# EAGLE design atxmega_e5_1 (EAGLE 6.5.0)
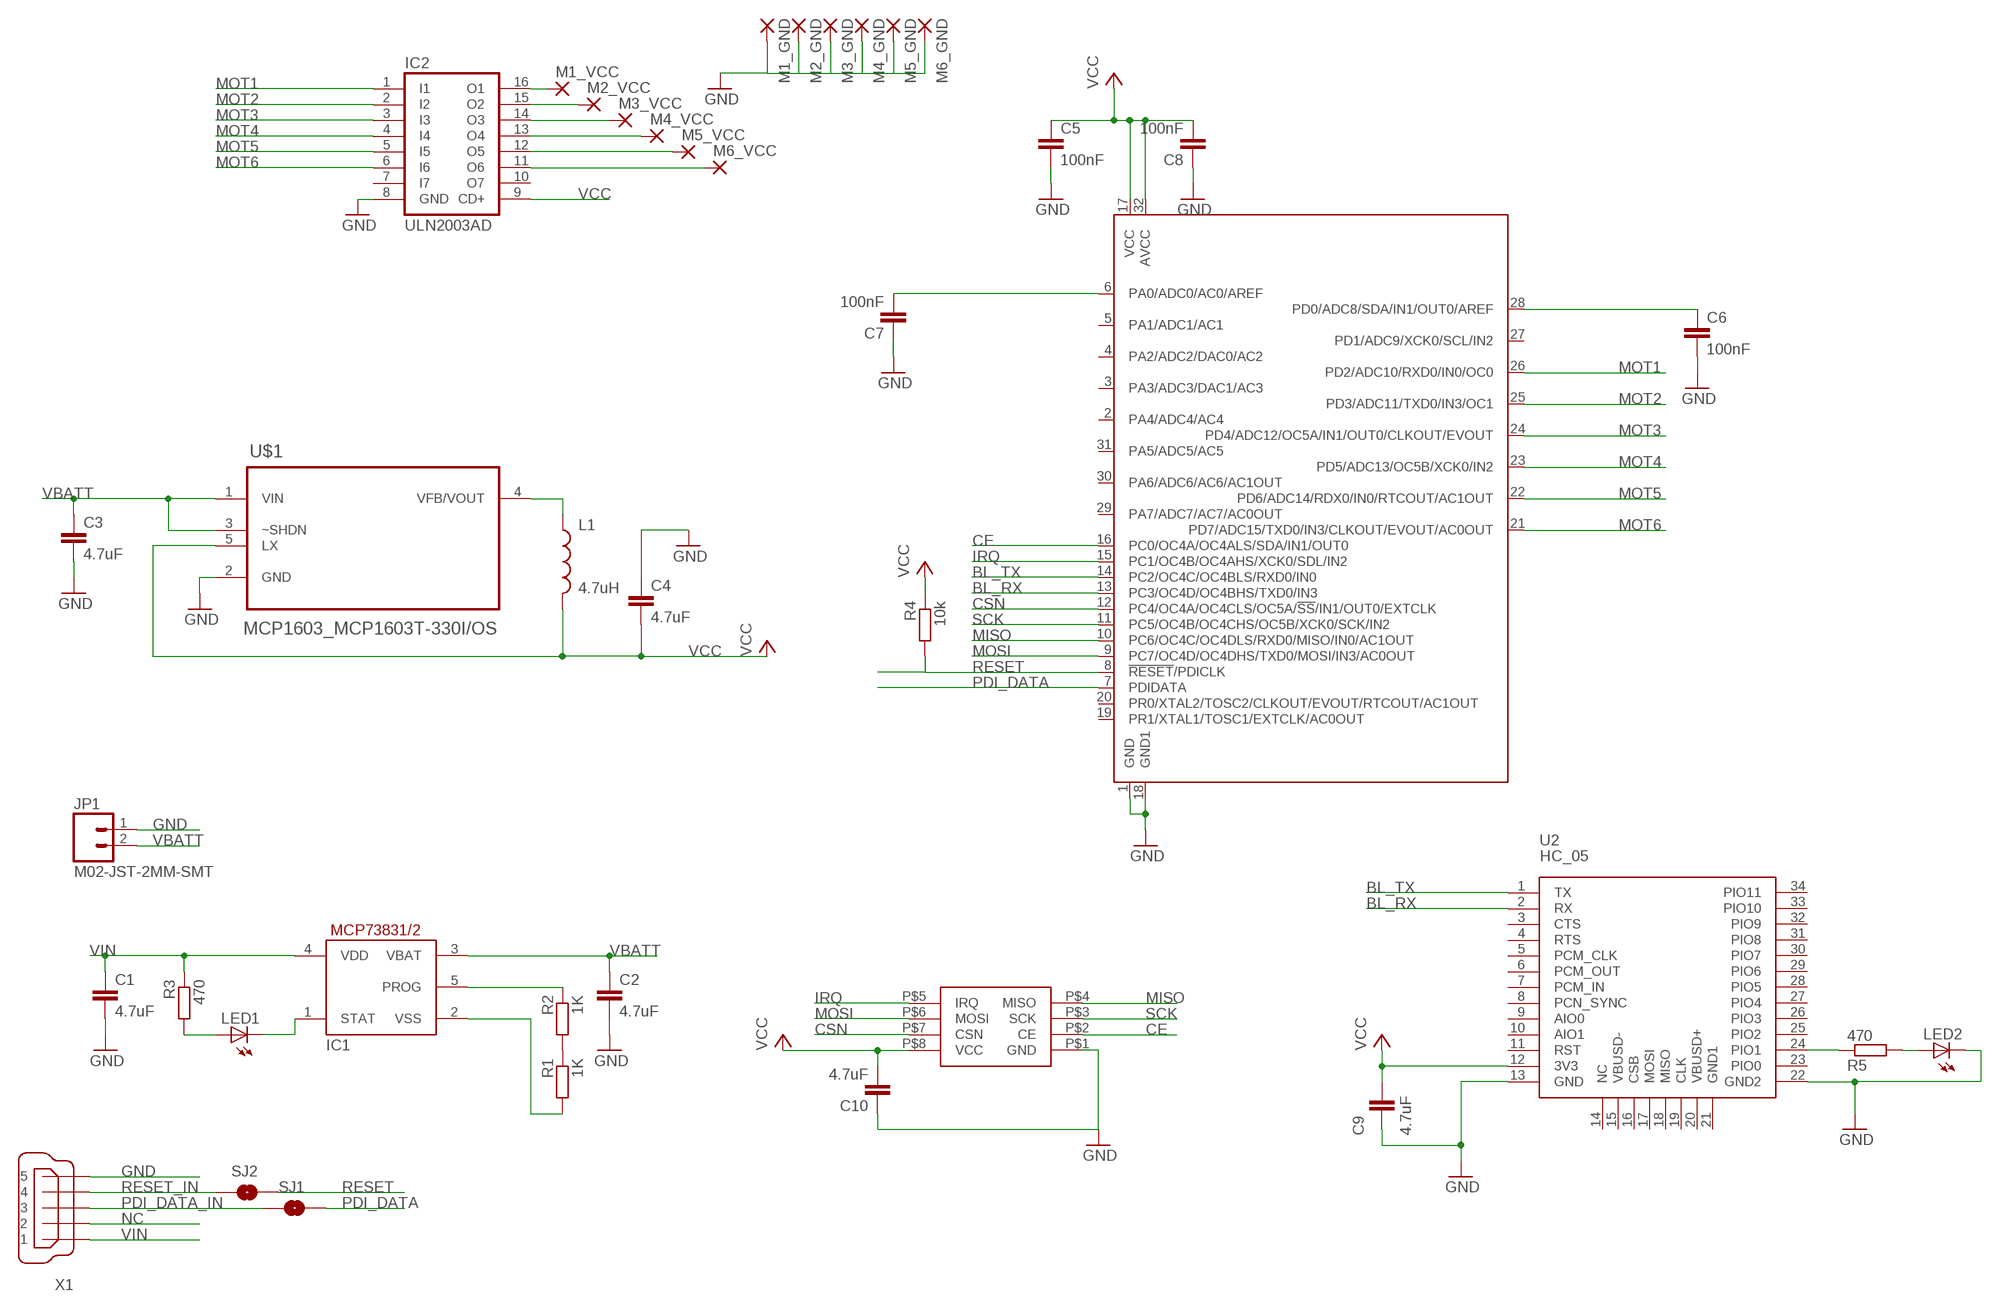
[diagram p0: schematic, sheet 1]

## Parts
C1  4.7uF  C-EUC0603K  [C0603K]
C2  4.7uF  C-EUC0603K  [C0603K]
C3  4.7uF  C-EUC0603K  [C0603K]
C4  4.7uF  C-EUC0603K  [C0603K]
C5  100nF  C-EUC0603K  [C0603K]
C6  100nF  C-EUC0603K  [C0603K]
C7  100nF  C-EUC0603K  [C0603K]
C8  100nF  C-EUC0603K  [C0603K]
C9  4.7uF  C-EUC0603K  [C0603K]
C10  4.7uF  C-EUC0603K  [C0603K]
IC1  MCP73831/OT  [SOT23-5L]
IC2  ULN2003AD  [SO16]
JP1  M02-JST-2MM-SMT  [JST-2-SMD]
L1  4.7uH  INDUCTOR1007  [1007]
LED1  LED0805LED  [0805LED]
LED2  LED0805LED  [0805LED]
M1_GND  WIREPAD2,15/1,0  [2,15/1,0]
M1_VCC  WIREPAD2,15/1,0  [2,15/1,0]
M2_GND  WIREPAD2,15/1,0  [2,15/1,0]
M2_VCC  WIREPAD2,15/1,0  [2,15/1,0]
M3_GND  WIREPAD2,15/1,0  [2,15/1,0]
M3_VCC  WIREPAD2,15/1,0  [2,15/1,0]
M4_GND  WIREPAD2,15/1,0  [2,15/1,0]
M4_VCC  WIREPAD2,15/1,0  [2,15/1,0]
M5_GND  WIREPAD2,15/1,0  [2,15/1,0]
M5_VCC  WIREPAD2,15/1,0  [2,15/1,0]
M6_GND  WIREPAD2,15/1,0  [2,15/1,0]
M6_VCC  WIREPAD2,15/1,0  [2,15/1,0]
R1  1K  R-EU_R0603  [R0603]
R2  1K  R-EU_R0603  [R0603]
R3  470  R-EU_R0603  [R0603]
R4  10k  R-EU_R0603  [R0603]
R5  470  R-EU_R0603  [R0603]
SJ1  SOLDERJUMPERNO  [SJ_2S-NO]
SJ2  SOLDERJUMPERNO  [SJ_2S-NO]
U1  ATXMEGAE5AU  [TQFP32]
U2  HC_05  [BLUETOOTH_SMD]
U$1  MCP1603_MCP1603T-330I/OS  [MCP1603_SOT95P280X110-5N]
U$2  NRF24L01+  [NRF24L01+]
X1  MINI-USB-32005-201  [32005-201]

## Nets
BL_RX: U1.13(PC3/OC4D/OC4BHS/TXD0/IN3) U2.2(RX)
BL_TX: U1.14(PC2/OC4C/OC4BLS/RXD0/IN0) U2.1(TX)
CE: U1.16(PC0/OC4A/OC4ALS/SDA/IN1/OUT0) U$2.P$2(CE)
CSN: U1.12(PC4/OC4A/OC4CLS/OC5A/!SS!/IN1/OUT0/EXTCLK) U$2.P$7(CSN)
GND: C1.2 C2.2 C3.2 C4.1 C5.2 C6.2 C7.1 C8.1 C9.2 C10.1 IC2.8(GND) JP1.1 LED2.C M1_GND.1(P) M2_GND.1(P) M3_GND.1(P) M4_GND.1(P) M5_GND.1(P) M6_GND.1(P) U1.1(GND) U1.18(GND1) U2.13(GND) U2.22(GND2) U$1.2(GND) U$2.P$1(GND) X1.5
IRQ: U1.15(PC1/OC4B/OC4AHS/XCK0/SDL/IN2) U$2.P$5(IRQ)
MISO: U1.10(PC6/OC4C/OC4DLS/RXD0/MISO/IN0/AC1OUT) U$2.P$4(MISO)
MOSI: U1.9(PC7/OC4D/OC4DHS/TXD0/MOSI/IN3/AC0OUT) U$2.P$6(MOSI)
MOT1: IC2.1(I1) U1.26(PD2/ADC10/RXD0/IN0/OC0)
MOT2: IC2.2(I2) U1.25(PD3/ADC11/TXD0/IN3/OC1)
MOT3: IC2.3(I3) U1.24(PD4/ADC12/OC5A/IN1/OUT0/CLKOUT/EVOUT)
MOT4: IC2.4(I4) U1.23(PD5/ADC13/OC5B/XCK0/IN2)
MOT5: IC2.5(I5) U1.22(PD6/ADC14/RDX0/IN0/RTCOUT/AC1OUT)
MOT6: IC2.6(I6) U1.21(PD7/ADC15/TXD0/IN3/CLKOUT/EVOUT/AC0OUT)
N$2: IC2.16(O1) M1_VCC.1(P)
N$3: IC2.15(O2) M2_VCC.1(P)
N$4: IC2.14(O3) M3_VCC.1(P)
N$5: IC2.13(O4) M4_VCC.1(P)
N$6: IC2.12(O5) M5_VCC.1(P)
N$7: IC2.11(O6) M6_VCC.1(P)
N$9: L1.1 U$1.4(VFB/VOUT)
N$10: LED1.A R3.2
N$11: IC1.1(STAT) LED1.C
N$12: IC1.5(PROG) R2.1
N$13: R1.1 R2.2
N$14: IC1.2(VSS) R1.2
N$20: LED2.A R5.2
N$21: R5.1 U2.24(PIO1)
N$24: C6.1 U1.28(PD0/ADC8/SDA/IN1/OUT0/AREF)
N$25: C7.2 U1.6(PA0/ADC0/AC0/AREF)
NC: X1.2
PDI_DATA: SJ1.2 U1.7(PDIDATA)
PDI_DATA_IN: SJ1.1 X1.3
RESET: R4.2 SJ2.2 U1.8(!RESET!/PDICLK)
RESET_IN: SJ2.1 X1.4
SCK: U1.11(PC5/OC4B/OC4CHS/OC5B/XCK0/SCK/IN2) U$2.P$3(SCK)
VBATT: C2.1 C3.1 IC1.3(VBAT) JP1.2 U$1.1(VIN) U$1.3(~SHDN)
VCC: C4.2 C5.1 C8.2 C9.1 C10.2 IC2.9(CD+) L1.2 R4.1 U1.17(VCC) U1.32(AVCC) U2.12(3V3) U$1.5(LX) U$2.P$8(VCC)
VIN: C1.1 IC1.4(VDD) R3.1 X1.1
Unconnected: IC2.7(I7) IC2.10(O7) U1.2(PA4/ADC4/AC4) U1.3(PA3/ADC3/DAC1/AC3) U1.4(PA2/ADC2/DAC0/AC2) U1.5(PA1/ADC1/AC1) U1.19(PR1/XTAL1/TOSC1/EXTCLK/AC0OUT) U1.20(PR0/XTAL2/TOSC2/CLKOUT/EVOUT/RTCOUT/AC1OUT) U1.27(PD1/ADC9/XCK0/SCL/IN2) U1.29(PA7/ADC7/AC7/AC0OUT) U1.30(PA6/ADC6/AC6/AC1OUT) U1.31(PA5/ADC5/AC5) U2.3(CTS) U2.4(RTS) U2.5(PCM_CLK) U2.6(PCM_OUT) U2.7(PCM_IN) U2.8(PCN_SYNC) U2.9(AIO0) U2.10(AIO1) U2.11(RST) U2.14(NC) U2.15(VBUSD-) U2.16(CSB) U2.17(MOSI) U2.18(MISO) U2.19(CLK) U2.20(VBUSD+) U2.21(GND1) U2.23(PIO0) U2.25(PIO2) U2.26(PIO3) U2.27(PIO4) U2.28(PIO5) U2.29(PIO6) U2.30(PIO7) U2.31(PIO8) U2.32(PIO9) U2.33(PIO10) U2.34(PIO11)

## Library data of the parts
C1-C10 = resistor:C-EU: CAPACITOR, European symbol
IC1 = adafruit:MCP73831: MCP73831/2 Miniature Single-Cell, Fully Integrated Li-Ion, Li-Polymer Charge Management Controllers. Nice and small simple lipoly charge controller, with adjustable current and status output (LED) http://www.ladyada.net/library/pcb/eaglelibrary.html
IC2 = uln-udn:ULN2003A: DRIVER ARRAY
JP1 = SparkFun-Connectors:M02: Standard 2-pin 0.1" header. Use with - straight break away headers ( PRT-00116) - right angle break away headers (PRT-00553) - swiss pins (PRT-00743) - machine pins (PRT-00117) - female headers (PRT-00115) Molex polarized connector foot print use with: PRT-08233 with associated crimp pins and housings. 2.54_SCREWTERM for use with PRT-10571. 3.5mm Screw Terminal footprints for PRT-08084 5mm Screw Terminal footprints for use with PRT-08433; PROD_ID: CONN-08352
L1 = SparkFun-Passives:INDUCTOR: Inductors Basic Inductor/Choke - 0603 and 1206. Footprints are not proven and vary greatly between part numbers. SRN6045- 33uH, 20% 1.4A SDR0403-560KL - 56uH, 10%, 500mA RMS/740mA peak
LED1 LED2 = LEDs:LED
M1_GND M1_VCC M2_GND M2_VCC M3_GND M3_VCC M4_GND M4_VCC M5_GND M5_VCC M6_GND M6_VCC = wirepad:WIREPAD: Wire PAD connect wire on PCB
R1-R5 = resistor:R-EU_: RESISTOR, European symbol
SJ1 SJ2 = SparkFun-Passives:SOLDERJUMPER: Solder Jumper Standard SMD solder jumper. Used to automate production. Two varients : Normally Open and Normally Closed are the same, but have different paste layers. NC will have a large amount of paste and should jumper during reflow.
U1 = 01jyd:ATXMEGAE5
U2 = Bluetooth HC-05:HC_05: HC-05 Bluetooth Module
U$1 = doska-digital:MCP1603_MCP1603T-330I/OS: 2.0 MHz, 500 mA Synchronous Buck Regulator; MPN: MCP1603T-330I/OS; OC_FARNELL: 1439373; OC_NEWARK: 22K1332; PACKAGE: SOT23-5; SUPPLIER: Microchip
U$2 = muzy_robot:NRF24L01+: NRF24L01+ module
X1 = con-cypressindustries:MINI-USB-: MINI USB-B Conector Source: www.cypressindustries.com; OC_FARNELL: unknown; OC_NEWARK: unknown

## Board
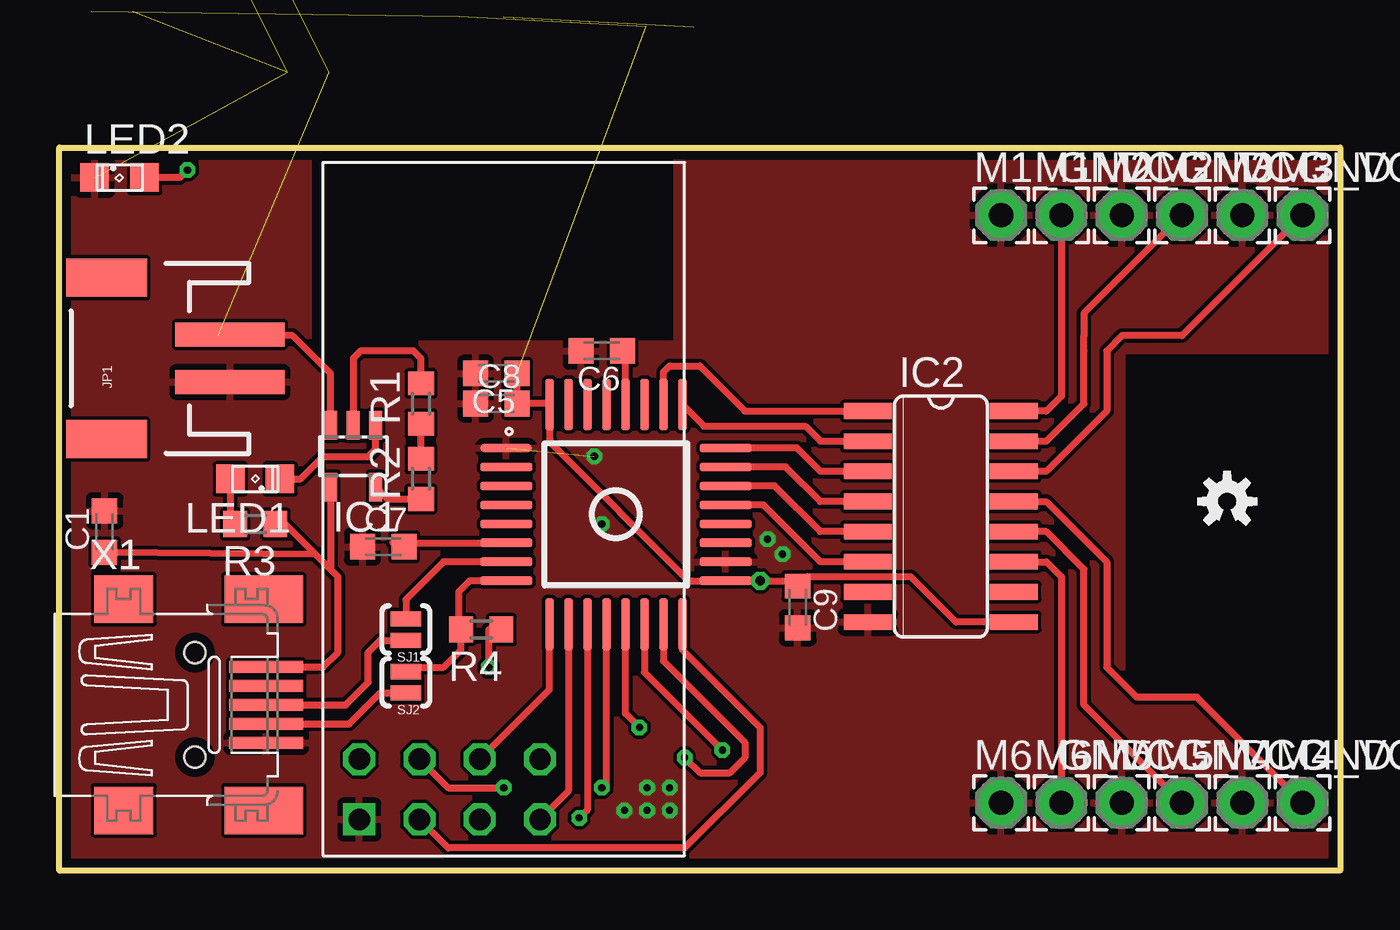
[diagram p1: board, top side]
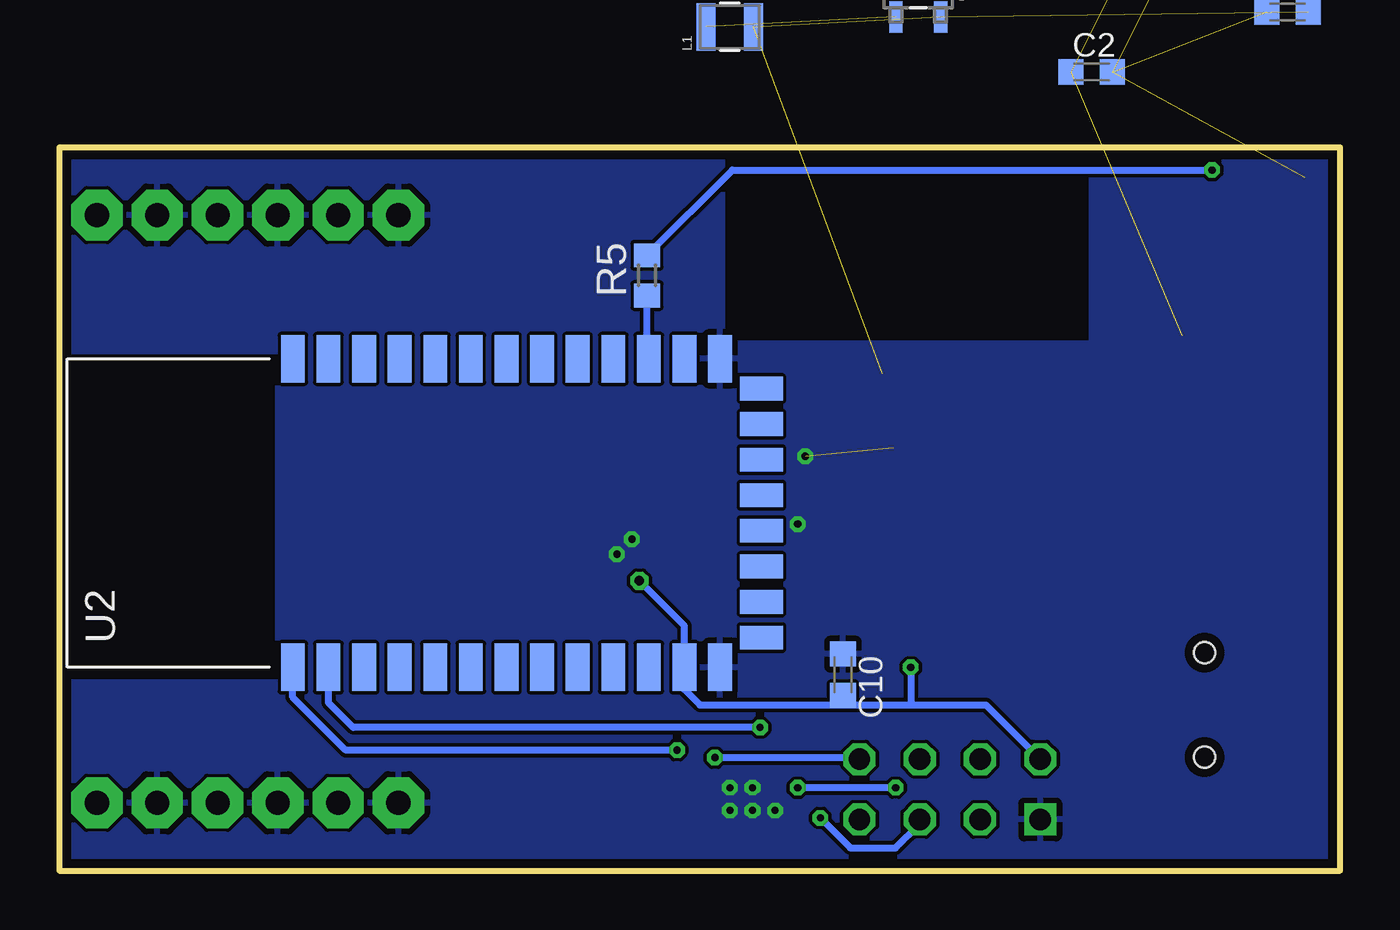
[diagram p2: board, bottom side, seen from below]

Size 53.98 x 30.48 mm. Coordinates in mm from the lower left corner, seen from the top.
Outline: 0,30.48 53.97,30.48 53.97,0 0,0 0,30.48
Copper layers (1*16): Top 0.0356mm / dielectric 1.5011mm / Bottom 0.0356mm
Design rules "LaenPCBOrder *": minimum track width 6mil, minimum drill 13mil, track to track 6mil, track to pad 6mil, pad to pad 6mil, via to via 6mil, smd to smd 6mil, copper to edge 15mil, drill to drill 6mil, minimum pad ring 7mil, minimum via ring 7mil, stop-mask expansion 4mil, vias tented up to drill 16mil, thermal gap 10mil

### Footprints (pad centres in the part's own frame; a part is rotated, then mirrored left to right if it is on the bottom)
C0603K = smd 1.05 x 1.08: 1 -0.875,0; 2 0.875,0
SOT23-5L = smd 0.55 x 1.2: 1 -0.95,-1.3; 2 0,-1.3; 3 0.95,-1.3; 4 0.95,1.3; 5 -0.95,1.3
SO16 = smd 0.66 x 2.032: 1 -4.445,-3.073; 2 -3.175,-3.073; 3 -1.905,-3.073; 4 -0.635,-3.073; 5 0.635,-3.073; 6 1.905,-3.073; 7 3.175,-3.073; 8 4.445,-3.073; 9 4.445,3.073; 10 3.175,3.073; 11 1.905,3.073; 12 0.635,3.073; 13 -0.635,3.073; 14 -1.905,3.073; 15 -3.175,3.073; 16 -4.445,3.073
JST-2-SMD = smd 1 x 4.6: 1 -1,-3.7; 2 1,-3.7 | smd 1.6 x 3.4: NC1 -3.4,1.5; NC2 3.4,1.5
1007 = smd 2 x 0.8: 1 0,1; 2 0,-1
0805LED = smd 1.2 x 1.2: A 1.05,0; C -1.05,0
2,15/1,0 = drill 1.016 pad 2.159 octagon: 1 0,0
R0603 = smd 1 x 1.1: 1 -0.85,0; 2 0.85,0
SJ_2S-NO = smd 0.635 x 1.27: 1 -0.45,0; 2 0.45,0
TQFP32 = smd 2.17 x 0.36: 1 -4.625,2.8; 2 -4.625,2; 3 -4.625,1.2; 4 -4.625,0.4; 5 -4.625,-0.4; 6 -4.625,-1.2; 7 -4.625,-2; 8 -4.625,-2.8; 17 4.625,-2.8; 18 4.625,-2; 19 4.625,-1.2; 20 4.625,-0.4; 21 4.625,0.4; 22 4.625,1.2; 23 4.625,2; 24 4.625,2.8 | smd 0.36 x 2.17: 9 -2.8,-4.625; 10 -2,-4.625; 11 -1.2,-4.625; 12 -0.4,-4.625; 13 0.4,-4.625; 14 1.2,-4.625; 15 2,-4.625; 16 2.8,-4.625; 25 2.8,4.625; 26 2,4.625; 27 1.2,4.625; 28 0.4,4.625; 29 -0.4,4.625; 30 -1.2,4.625; 31 -2,4.625; 32 -2.8,4.625
BLUETOOTH_SMD = smd 2 x 1: 1 -6.35,3.81; 2 -6.35,2.31; 3 -6.35,0.81; 4 -6.35,-0.69; 5 -6.35,-2.19; 6 -6.35,-3.69; 7 -6.35,-5.19; 8 -6.35,-6.69; 9 -6.35,-8.19; 10 -6.35,-9.69; 11 -6.35,-11.19; 12 -6.35,-12.69; 13 -6.35,-14.19; 22 6.65,-14.19; 23 6.65,-12.69; 24 6.65,-11.19; 25 6.65,-9.69; 26 6.65,-8.19; 27 6.65,-6.69; 28 6.65,-5.19; 29 6.65,-3.69; 30 6.65,-2.19; 31 6.65,-0.69; 32 6.65,0.81; 33 6.65,2.31; 34 6.65,3.81 | smd 1 x 1.8: 14 -5.1,-15.94; 15 -3.6,-15.94; 16 -2.1,-15.94; 17 -0.6,-15.94; 18 0.9,-15.94; 19 2.4,-15.94; 20 3.9,-15.94; 21 5.4,-15.94
MCP1603_SOT95P280X110-5N = smd 1.321 x 0.559: 1 -1.168,0.94; 2 -1.168,0; 3 -1.168,-0.94; 4 1.168,-0.94; 5 1.168,0.94
NRF24L01+ = drill 0.9 square: P$1 -1.016,1.016 | drill 0.9 octagon: P$2 -1.016,-1.524; P$3 -1.016,-4.064; P$4 -1.016,-6.604; P$5 1.524,-6.604; P$6 1.524,-4.064; P$7 1.524,-1.524; P$8 1.524,1.016
32005-201 = smd 3.1 x 0.5: 1 3,1.6; 2 3,0.8; 3 3,0; 4 3,-0.8; 5 3,-1.6 | smd 2.5 x 2: M1 -3,-4.45; M2 -3,4.45 | smd 3.3 x 2: M3 2.9,4.45; M4 2.9,-4.45 | hole 0.9: 0,2.2; 0,-2.2

### Placement (x,y rotation side)
C1  1.91,14.29 90 top
C2  10.48,33.66 0 bottom  (outside the outline)
C3  7.94,38.73 0 bottom  (outside the outline)
C4  2.22,36.2 0 bottom  (outside the outline)
C5  18.41,20.95 180 top
C6  22.86,21.91 180 top
C7  13.65,13.65 0 top
C8  18.41,19.69 0 top
C9  31.12,11.11 270 top
C10  20.96,8.25 270 bottom
IC1  12.38,17.46 180 top
IC2  37.15,14.92 270 top
JP1  3.49,21.59 90 top
L1  25.72,35.56 90 bottom  (outside the outline)
LED1  8.26,16.51 180 top
LED2  2.54,29.21 0 top
M1_GND  39.69,27.62 0 top
M1_VCC  42.23,27.62 0 top
M2_GND  44.77,27.62 0 top
M2_VCC  47.31,27.62 0 top
M3_GND  49.85,27.62 0 top
M3_VCC  52.39,27.62 0 top
M4_GND  49.85,2.86 0 top
M4_VCC  52.39,2.86 0 top
M5_GND  44.77,2.86 0 top
M5_VCC  47.31,2.86 0 top
M6_GND  39.69,2.86 0 top
M6_VCC  42.23,2.86 0 top
R1  15.24,19.69 90 top
R2  15.24,16.51 90 top
R3  8.26,14.61 180 top
R4  17.78,10.16 180 top
R5  29.21,25.08 90 bottom
SJ1  14.61,10.16 90 top
SJ2  14.61,7.94 90 top
U1  23.46,15.02 0 top
U2  40.32,14.92 90 bottom
U$1  17.78,37.15 270 bottom  (outside the outline)
U$2  13.65,3.17 90 top
X1  5.72,6.99 0 top

### Tracks (layer width: path | path; a pad name or v marks a point on that pad's centre or on a via)
BL_RX  (via drill 0.3)
  Top 0.305: v24.45,6.03 23.86,6.62 U1.13
  Bottom 0.305: v24.45,6.03 41.59,6.03 42.63,7.07 U2.2
BL_TX  (via drill 0.3)
  Top 0.305: U1.14 24.66,8.36 v27.94,5.08
  Bottom 0.305: v27.94,5.08 41.91,5.08 44.13,7.3 U2.1
CE
  Top 0.305: U1.16 26.26,9.3 29.53,6.03 29.53,4.13 26.35,0.95 16.38,0.95 U$2.P$2
CSN  (via drill 0.3)
  Top 0.305: U$2.P$7 16.38,3.49 v18.73,3.49 | v22.86,3.49 arc-90 23.06,3.61 U1.12
  Bottom 0.305: v18.73,3.49 v22.86,3.49
GND  (via drill 0.3)  (5 unrouted)
  other vias: 29.85,13.97 30.48,13.33 22.54,17.46 22.86,14.61 24.77,2.54 25.72,2.54 24.77,3.49 25.72,3.49 23.81,2.54
  pour Top: 0.32,30.16 10.48,30.48 10.48,22.23 26.04,22.23 26.04,30.16 53.66,30.16 53.66,21.91 44.77,21.91 44.77,7.94 53.66,7.94 53.66,0.32 45.09,0 0.32,0
  pour Bottom: 0.32,30.48 10.48,30.48 10.48,22.23 26.04,22.23 26.04,30.16 53.66,30.16 53.66,21.91 44.77,21.91 44.77,7.94 53.66,7.94 53.66,0.32 45.09,0 0.32,0
IRQ  (via drill 0.3)
  Top 0.305: U1.15 25.46,8.83 28.89,5.4 28.89,4.76 28.26,4.13 26.99,4.13 v26.35,4.76
  Bottom 0.305: U$2.P$5 arc-90 20.32,4.76 v26.35,4.76
MISO
  Top 0.305: U1.10 21.46,3.36 U$2.P$4
MOSI
  Top 0.305: U$2.P$6 20.66,7.64 U1.9
MOT1
  Top 0.305: U1.26 25.46,21.01 25.72,21.27 26.99,21.27 28.89,19.37 IC2.1
MOT2
  Top 0.305: U1.25 27.16,18.73 31.43,18.73 32.07,18.1 IC2.2
MOT3
  Top 0.305: IC2.3 32.07,16.83 31.08,17.82 U1.24
MOT4
  Top 0.305: IC2.4 32.07,15.56 30.61,17.02 U1.23
MOT5
  Top 0.305: IC2.5 32.07,14.29 30.14,16.22 U1.22
MOT6
  Top 0.305: IC2.6 32.07,13.02 29.67,15.42 U1.21
N$1
  Top 0.005: 49.55,14.75 arc9 49.68,14.82 49.99,14.56 50.21,14.78 49.95,15.09 arc19 50.06,15.36 50.47,15.4 50.47,15.71 50.06,15.75 arc19 49.95,16.02 50.21,16.34 49.99,16.56 49.68,16.3 arc19 49.41,16.41 49.37,16.82 49.06,16.82 49.02,16.41 arc19 48.75,16.3 48.43,16.56 48.21,16.34 48.47,16.02 arc19 48.36,15.75 47.95,15.71 47.95,15.4 48.36,15.36 arc19 48.47,15.09 48.21,14.78 48.43,14.56 48.75,14.82 arc9 48.88,14.75 49.06,15.19 arc-68 48.82,15.56 arc-247 49.36,15.19 49.55,14.75
N$2
  Top 0.305: M1_VCC.1 42.23,20 41.59,19.37 IC2.16
N$3
  Top 0.305: IC2.15 41.59,18.1 43.18,19.69 43.18,21.91 43.18,22.54 43.18,23.49 M2_VCC.1
N$4
  Top 0.305: IC2.14 41.59,16.83 44.13,19.37 44.13,21.91 44.77,22.54 47.31,22.54 M3_VCC.1
N$5
  Top 0.305: IC2.13 41.59,15.56 44.13,13.02 44.13,8.57 45.4,7.3 47.94,7.3 M4_VCC.1
N$6
  Top 0.305: IC2.12 41.59,14.29 43.18,12.7 43.18,6.99 M5_VCC.1
N$7
  Top 0.305: IC2.11 41.59,13.02 42.23,12.38 M6_VCC.1
N$9  (1 unrouted)
N$10
  Top 0.305: LED1.A 7.21,14.8 R3.2
N$11
  Top 0.305: LED1.C 10.16,16.51 11.11,17.46 13.02,17.46 13.33,17.78 IC1.1
N$12
  Top 0.305: IC1.5 13.83,15.66 R2.1
N$13
  Top 0.305: R2.2 R1.1
N$14
  Top 0.305: R1.2 15.24,21.59 14.92,21.91 12.7,21.91 12.38,21.59 IC1.2
N$20  (via drill 0.3)
  Top 0.305: v5.4,29.53 5.08,29.21 LED2.A
  Bottom 0.305: R5.2 25.62,29.53 v5.4,29.53
N$21
  Bottom 0.305: U2.24 29.21,21.65 R5.1
N$24
  Top 0.305: U1.28 23.86,21.79 C6.1
N$25
  Top 0.305: C7.2 14.06,13.82 U1.6
PDI_DATA
  Top 0.305: U1.7 16.19,13.02 14.61,11.43 SJ1.2
PDI_DATA_IN
  Top 0.305: X1.3 12.07,6.99 13.02,7.94 13.02,9.21 13.52,9.71 SJ1.1
RESET
  Top 0.305: SJ2.2 14.79,8.57 16.19,8.57 16.93,9.31 R4.2 16.83,10.26 16.83,11.75 17.3,12.22 U1.8
RESET_IN
  Top 0.305: X1.4 12.22,6.19 13.52,7.49 SJ2.1
SCK  (via drill 0.3)
  Top 0.305: U1.11 22.26,2.57 v21.91,2.22
  Bottom 0.305: v21.91,2.22 20.64,0.95 18.73,0.95 17.72,1.97 U$2.P$3
VBATT  (4 unrouted)
  Top 0.305: IC1.3 11.43,20.95 9.84,22.54 7.3,22.54 | 7.3,22.54 7.24,22.54 | 7.24,22.54 JP1.2 7.26,22.59 7.3,22.54 | 6.67,22.54 7.24,22.54
VCC  (via drill 0.3, 0.4)  (3 unrouted)
  Top 0.305: IC2.9 37.78,10.48 35.88,12.38 31.51,12.38 C9.1 30.89,12.22 v29.53,12.22 U1.17 26.52,12.22 20.66,18.08 U1.32 20.61,19.69 C8.2 C5.1 | R4.1 18.1,10.16 v18.1,8.57
  Bottom 0.305: v29.53,12.22 27.63,10.32 U2.12 27.63,7.63 26.99,6.99 21.27,6.99 | 21.27,6.99 18.1,6.99 | 18.1,6.99 14.92,6.99 U$2.P$8 | v18.1,8.57 18.1,6.99 | C10.2 21.27,7.06 21.27,6.99
VIN
  Top 0.305: X1.1 11.12,8.59 11.75,9.21 11.75,12.38 11.43,12.7 | 11.43,12.7 11.11,13.02 10.79,13.33 | 10.79,13.33 C1.1 | IC1.4 11.43,12.7 | R3.1 9.52,14.61 10.79,13.33